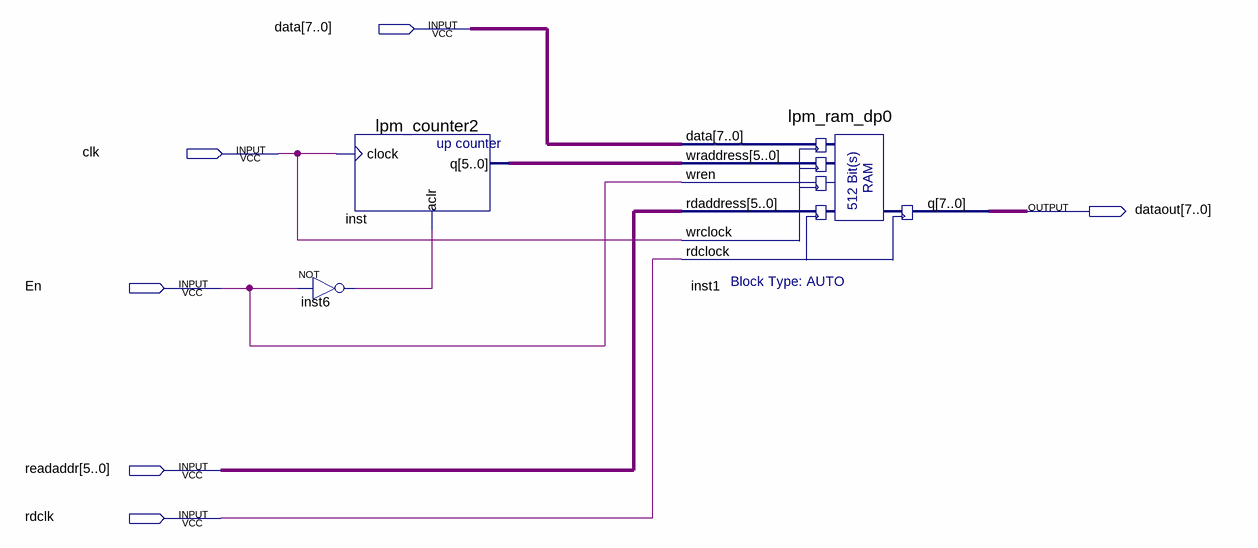
[diagram p0: schematic sheet]
// Quartus schematic buff.bdf as structural Verilog: 3 symbols, 6 pins
module buff (
  input  [7:0] data,
  input  clk,
  input  En,
  input  [5:0] readaddr,
  input  rdclk,
  output [7:0] dataout
);

  wire inst6_out;
  wire [5:0] inst_q;

  lpm_counter2 inst (.clock(clk), .aclr(inst6_out), .q(inst_q));
  not inst6 (inst6_out, En);
  lpm_ram_dp0 inst1 (
    .data(data), .wraddress(inst_q), .wren(En), .rdaddress(readaddr), .wrclock(clk), .rdclock(rdclk),
    .q(dataout));
endmodule
